# EAGLE design Master_V0.1 (EAGLE 9.6.2)

## Sheet 1 of 2
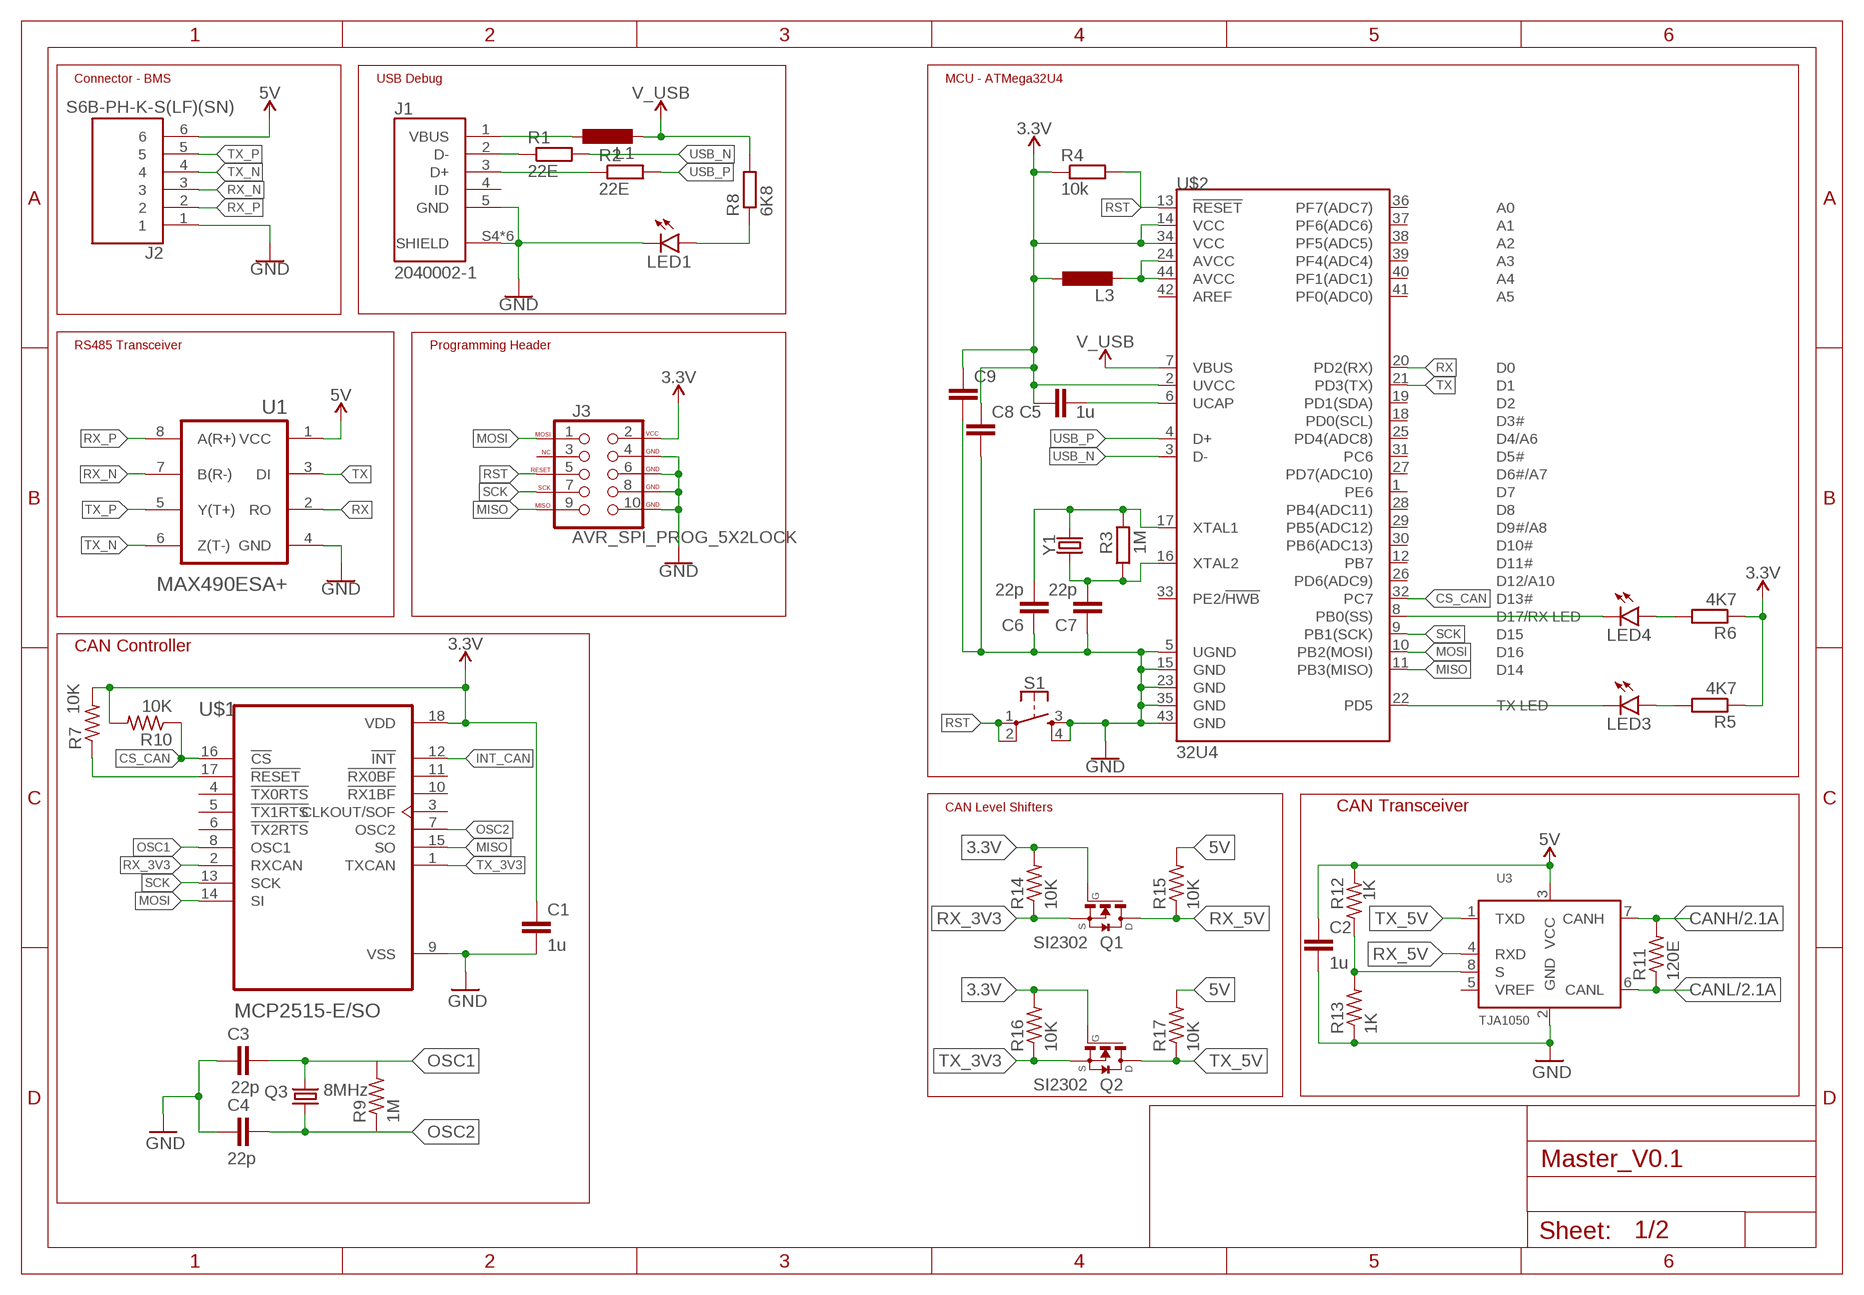
[diagram p0: schematic, sheet 1]

### Parts
C1  1u  C-EUC0805  [C0805]
C2  1u  C-EUC0805  [C0805]
C3  22p  C-EUC0805  [C0805]
C4  22p  C-EUC0805  [C0805]
C5  1u  C-EUC0805  [C0805]
C6  22p  C-EUC0805  [C0805]
C7  22p  C-EUC0805  [C0805]
C8  C-EUC0805  [C0805]
C9  C-EUC0805  [C0805]
J1  2040002-1  [TE_2040002-1]
J2  S6B-PH-K-S(LF)(SN)  [JST_S6B-PH-K-S(LF)(SN)]
J3  AVR_SPI_PROG_5X2LOCK  [2X5-SHROUDED_LOCK]
L1  L-EUL2012C  [L2012C]
L3  L-EUL2012C  [L2012C]
LED1  LEDCHIPLED_0805  [CHIPLED_0805]
LED3  LEDCHIPLED_0805  [CHIPLED_0805]
LED4  LEDCHIPLED_0805  [CHIPLED_0805]
Q1  SI2302  [SOT23]
Q2  SI2302  [SOT23]
Q3  8MHz  CRYSTALHC49S  [HC49/S]
R1  22E  R-EU_R0805  [R0805]
R2  22E  R-EU_R0805  [R0805]
R3  1M  R-EU_R0805  [R0805]
R4  10k  R-EU_R0805  [R0805]
R5  4K7  R-EU_R0805  [R0805]
R6  4K7  R-EU_R0805  [R0805]
R7  10K  R-US_R0805  [R0805]
R8  6K8  R-EU_R0805  [R0805]
R9  1M  R-US_R0805  [R0805]
R10  10K  R-US_R0805  [R0805]
R11  120E  R-US_R0805  [R0805]
R12  1K  R-US_R0805  [R0805]
R13  1K  R-US_R0805  [R0805]
R14  10K  R-US_R0805  [R0805]
R15  10K  R-US_R0805  [R0805]
R16  10K  R-US_R0805  [R0805]
R17  10K  R-US_R0805  [R0805]
S1  MOMENTARY-SWITCH-SPST-2-SMD-5.2MM  [TACTILE_SWITCH_SMD_5.2MM]
U1  MAX490ESA+  [SOIC127P600X175-8N]
U3  TJA1050  [SOT96-1]
U$1  MCP2515-E/SO  [SOIC127P1030X265-18N]
U$2  32U4  ATMEGA32U4TQFP-44  [TQFP44]
Y1  CRYSTALPTH-HC49UV  [HC49U]

### Nets
3.3V: C1.1 C5.1 C8.1 C9.1 J3.2(VCC) L3.1 Q1.1(G) Q2.1(G) R4.1 R5.1 R6.1 R7.2 R10.2 R14.2 R16.2 U$1.18(VDD) U$2.2(UVCC) U$2.14(VCC) U$2.34(VCC) ; also sheet 2
5V: C2.1 J2.6 R12.2 R15.2 R17.2 U1.1(VCC) U3.3(VCC) ; also sheet 2
CANH: R11.2 U3.7(CANH) ; also sheet 2
CANL: R11.1 U3.6(CANL) ; also sheet 2
CS_CAN: R10.1 U$1.16(!CS) U$2.32(PC7)
GND: C1.2 C2.2 C3.1 C4.1 C6.1 C7.1 C8.2 C9.2 J1.5(GND) J1.S4(SHIELD) J1.S5(SHIELD) J1.SH1(SHIELD) J1.SH2(SHIELD) J1.SH3(SHIELD) J1.SH4(SHIELD) J2.1 J3.4(GND) J3.6(GND) J3.8(GND) J3.10(GND) LED1.C R13.1 S1.3 S1.4 U1.4(GND) U3.2(GND) U$1.9(VSS) U$2.5(UGND) U$2.15(GND) U$2.23(GND) U$2.35(GND) U$2.43(GND) ; also sheet 2
INT_CAN: U$1.12(!INT)
MISO: J3.9(MISO) U$1.15(SO) U$2.11(PB3(MISO))
MOSI: J3.1(MOSI) U$1.14(SI) U$2.10(PB2(MOSI))
N$1: J1.3(D+) R2.1
N$2: J1.2(D-) R1.1
N$3: J1.1(VBUS) L1.1
N$4: L3.2 U$2.24(AVCC) U$2.44(AVCC)
N$5: LED1.A R8.1
N$6: R7.1 U$1.17(!RESET)
N$7: C5.2 U$2.6(UCAP)
N$8: LED3.C U$2.22(PD5)
N$9: C6.2 R3.2 U$2.17(XTAL1) Y1.2
N$10: LED3.A R5.2
N$11: C7.2 R3.1 U$2.16(XTAL2) Y1.1
N$12: LED4.C U$2.8(PB0(SS))
N$13: LED4.A R6.2
N$18: R12.1 R13.2 U3.8(S)
OSC1: C3.2 Q3.2 R9.2 U$1.8(OSC1)
OSC2: C4.2 Q3.1 R9.1 U$1.7(OSC2)
RST: J3.5(RESET) R4.2 S1.1 S1.2 U$2.13(!RESET)
RX: U1.2(RO) U$2.20(PD2(RX))
RX_3V3: Q1.2(S) R14.1 U$1.2(RXCAN)
RX_5V: Q1.3(D) R15.1 U3.4(RXD)
RX_N: J2.3 U1.7(B(R-))
RX_P: J2.2 U1.8(A(R+))
SCK: J3.7(SCK) U$1.13(SCK) U$2.9(PB1(SCK))
TX: U1.3(DI) U$2.21(PD3(TX))
TX_3V3: Q2.2(S) R16.1 U$1.1(TXCAN)
TX_5V: Q2.3(D) R17.1 U3.1(TXD)
TX_N: J2.4 U1.6(Z(T-))
TX_P: J2.5 U1.5(Y(T+))
USB_N: R1.2 U$2.3(D-)
USB_P: R2.2 U$2.4(D+)
V_USB: L1.2 R8.2 U$2.7(VBUS)
Unconnected: J1.4(ID) J3.3(NC) U3.5(VREF) U$1.3(CLKOUT/SOF) U$1.4(!TX0RTS) U$1.5(!TX1RTS) U$1.6(!TX2RTS) U$1.10(!RX1BF) U$1.11(!RX0BF) U$2.1(PE6) U$2.12(PB7) U$2.18(PD0(SCL)) U$2.19(PD1(SDA)) U$2.25(PD4(ADC8)) U$2.26(PD6(ADC9)) U$2.27(PD7(ADC10)) U$2.28(PB4(ADC11)) U$2.29(PB5(ADC12)) U$2.30(PB6(ADC13)) U$2.31(PC6) U$2.33(PE2/!HWB) U$2.36(PF7(ADC7)) U$2.37(PF6(ADC6)) U$2.38(PF5(ADC5)) U$2.39(PF4(ADC4)) U$2.40(PF1(ADC1)) U$2.41(PF0(ADC0)) U$2.42(AREF)

### Notes on the sheet
- Connector - BMS | USB Debug | MCU - ATMega32U4
- RS485 Transceiver | Programming Header
- CAN Controller
- CAN Level Shifters | CAN Transceiver

## Sheet 2 of 2
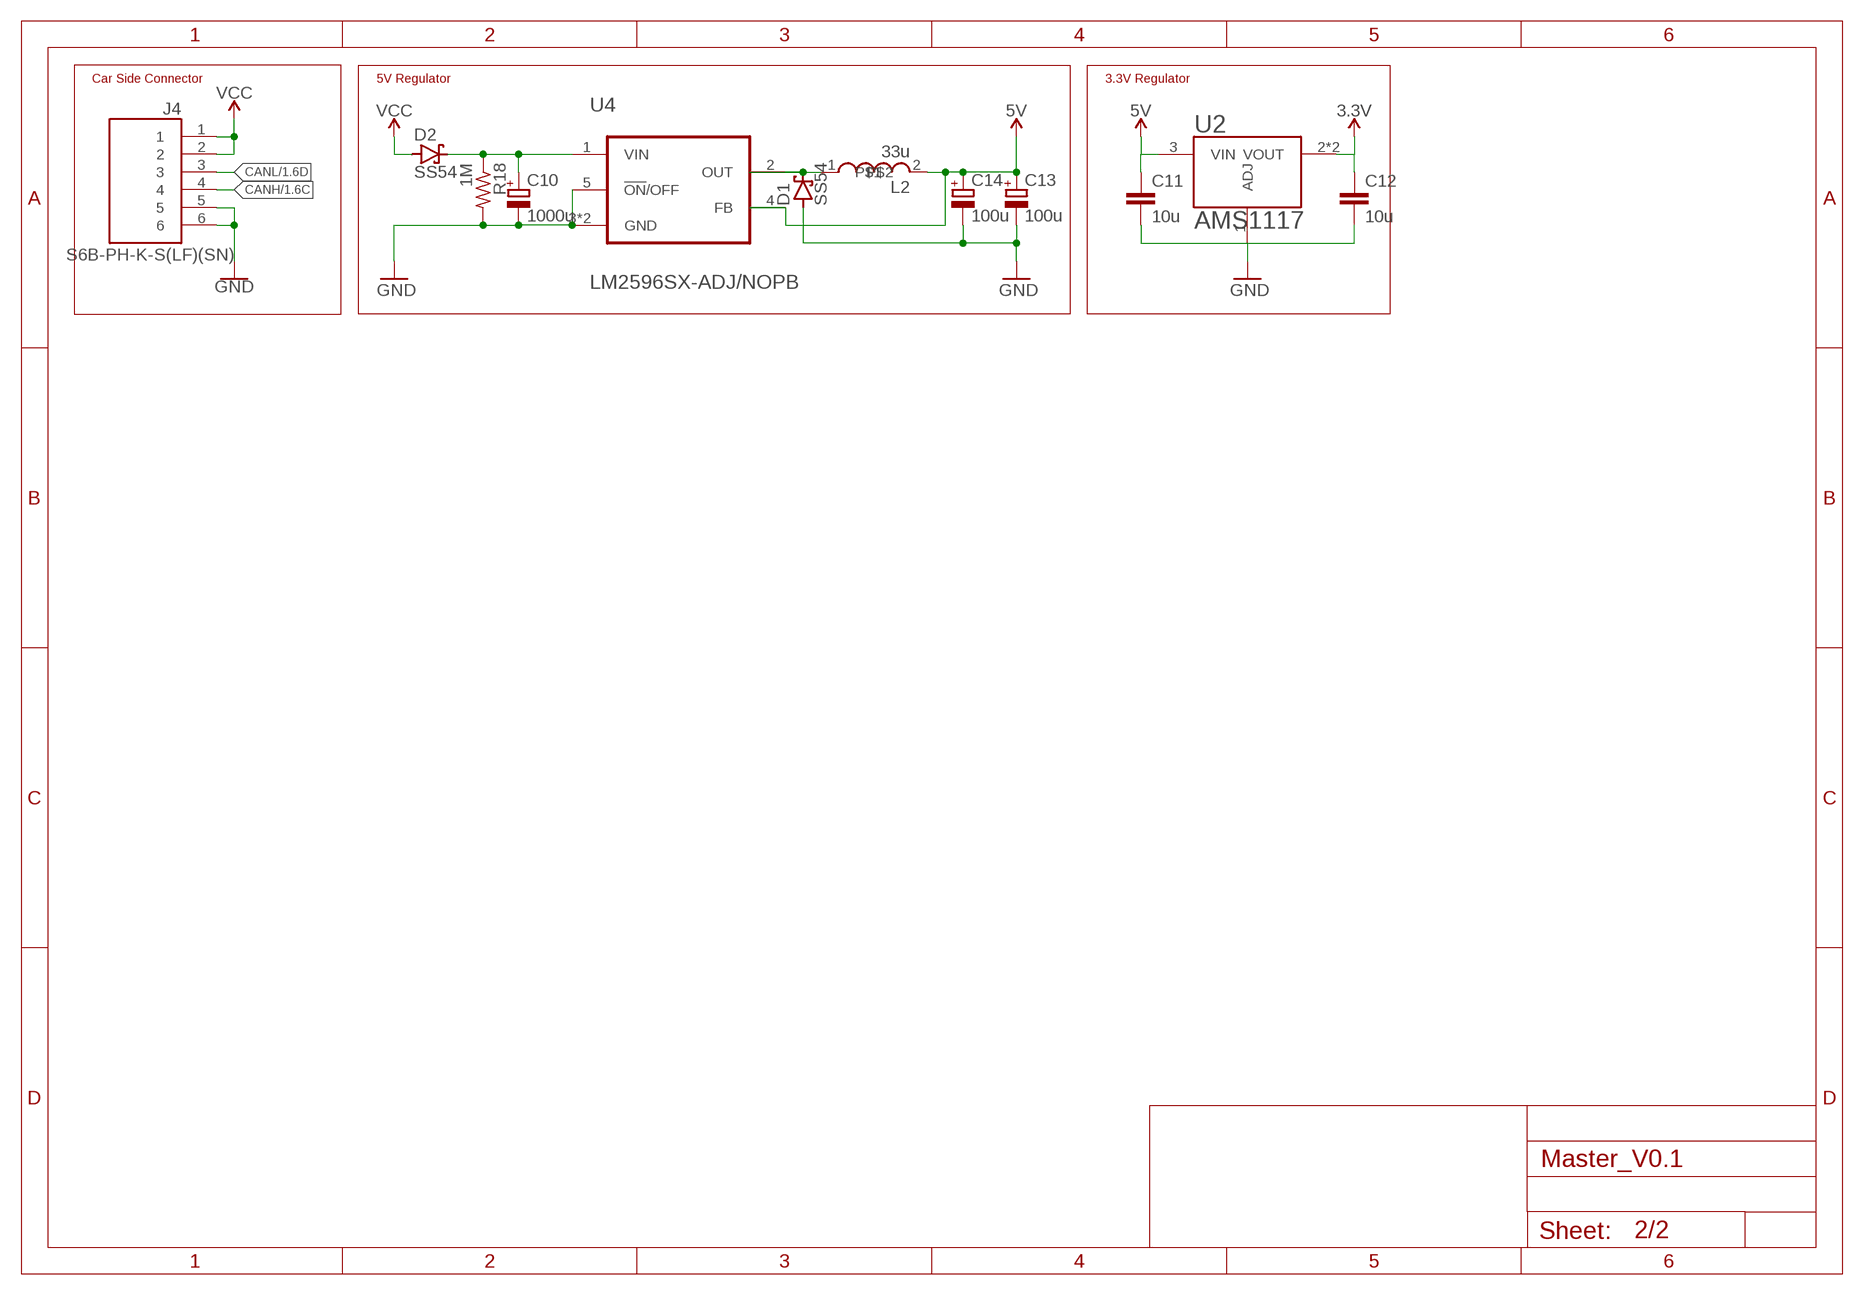
[diagram p1: schematic, sheet 2]

### Parts
C10  1000u  CPOL-EUE5-10.5  [E5-10,5]
C11  10u  C-EUC0805  [C0805]
C12  10u  C-EUC0805  [C0805]
C13  100u  CPOL-EUE2-4  [E2-4]
C14  100u  CPOL-EUE2-4  [E2-4]
D1  SS54  SCHOTTKY-DIODESMC  [SMC]
D2  SS54  SCHOTTKY-DIODESMC  [SMC]
J4  S6B-PH-K-S(LF)(SN)  [JST_S6B-PH-K-S(LF)(SN)]
L2  33u  CDRH127/LDCDRH/LD  [CDRH127/LD]
R18  1M  R-US_R0805  [R0805]
U2  AMS1117  [SOT230P700X170-4]
U4  LM2596SX-ADJ/NOPB  [VREG_LM2596SX-ADJ/NOPB]

### Nets
3.3V: C12.1 U2.2(VOUT) U2.4(VOUT) ; also sheet 1
5V: C11.1 C13.+ C14.+ L2.2 U2.3(VIN) U4.4(FB) ; also sheet 1
CANH: J4.4 ; also sheet 1
CANL: J4.3 ; also sheet 1
GND: C10.- C11.2 C12.2 C13.- C14.- D1.A J4.5 J4.6 R18.2 U2.1(ADJ) U4.3(GND) U4.5(!ON!/OFF) U4.6(GND) ; also sheet 1
N$14: D1.C L2.1 U4.2(OUT)
N$15: C10.+ D2.C R18.1 U4.1(VIN)
VCC: D2.A J4.1 J4.2

### Notes on the sheet
- Car Side Connector | 5V Regulator | 3.3V Regulator

## Library data of the parts
C1-C9 C11 C12 = rcl:C-EU: CAPACITOR, European symbol; SPICEPREFIX: C
C10 C13 C14 = rcl:CPOL-EU: POLARIZED CAPACITOR, European symbol; SPICEPREFIX: C
D1 D2 = diode:SCHOTTKY-DIODE: Schottky Diode
J1 = 2040002-1:2040002-1: Conn USB Type B RCP 5 POS 0.65mm Solder RA SMD 5 Terminal 1 Port T/R; AVAILABILITY: Unavailable; CENTERLINE_PITCH: .65 mm[.025 in]; COMMENT: 2040002-1; DESCRIPTION: Conn Micro USB 2.0 Type B RCP 5 POS 0.65mm Solder RA SMD 5 Terminal 1 Port T/R; MF: TE Connectivity; MP: 2040002-1; NUMBER_OF_POSITIONS: 5; PACKAGE: None; PRICE: None; PRODUCT_TYPE: Connector; TE_PURCHASE_URL: https://www.te.com/usa-en/product-2040002-1.html?te_bu=Cor&te_type=disp&te_campaign=seda_glo_cor-seda-global-disp-prtnr-fy19-seda-model-bom-cta_sma-317_1&elqCampaignId=32493
J2 J4 = S6B-PH-K-S_LF__SN_:S6B-PH-K-S(LF)(SN): PH Series 6 Position 2 mm Pitch Through Hole Side Entry Shrouded Header; AVAILABILITY: Unavailable; DESCRIPTION: Connector Header Through Hole, Right Angle 6 position 0.079 (2.00mm); MF: JST Sales; MP: S6B-PH-K-S(LF)(SN); PACKAGE: None; PRICE: None
J3 = SparkFun-Connectors:AVR_SPI_PROG_5X2: AVR 10-pin ICSP Header This is the standard AVR In Circuit Serial Programming header. Minimal, but includes pin one indicator. Works with standard Olimex programmers. SparkFun Products: 2x5 AVR ICSP Male Header <https://www.sparkfun.com/products/778> - PTH 2x5 Pin Shrouded Header <https://www.sparkfun.com/products/8506> - PTH2; PROD_ID: CONN-08671; SF_ID: PRT-08506
L1 L3 = rcl:L-EU: INDUCTOR, European symbol; SPICEPREFIX: L
L2 = L-CDRH127_LD:CDRH127/LD
LED1 LED3 LED4 = led:LED: LED OSRAM: - CHIPLED LG R971, LG N971, LY N971, LG Q971, LY Q971, LO R971, LY R971 LH N974, LH R974 LS Q976, LO Q976, LY Q976 LO Q996 - Hyper CHIPLED LW Q18S LB Q993, LB Q99A, LB R99A - SideLED LS A670, LO A670, LY A670, LG A670, LP A670 LB A673, LV A673, LT A673, LW A673 LH A674 LY A675 LS A676, LA A676, LO A676, LY A676, LW A676 LS A679, LY A679, LG A679 - Hyper Micro SIDELED® LS Y876, LA Y876, LO Y876, LY Y876 LT Y87S - SmartLED LW L88C, LW L88S LB L89C, LB L89S, LG L890 LS L89K, LO L89K, LY L89K LS L896, LA L896, LO L896, LY L896 - TOPLED LS T670, LO T670, LY T670, LG T670, LP T670 LSG T670, LSP T670, LSY T670, LOP T670, LYG T670 LG T671, LOG T671, LSG T671 LB T673, LV T673, LT T673, LW T673 LH T674 LS T676, LA T676, LO T676, LY T676, LB T676, LH T676, LSB T676, LW T676 LB T67C, LV T67C, LT T67C, LS T67K, LO T67K, LY T67K, LW E67C LS E67B, LA E67B, LO E67B, LY E67B, LB E67C, LV E67C, LT E67C LW T67C LS T679, LY T679, LG T679 LS T770, LO T770, LY T770, LG T770, LP T770 LB T773, LV T773, LT T773, LW T773 LH T774 LS E675, LA E675, LY E675, LS T675 LS T776, LA T776, LO T776, LY T776, LB T776 LHGB T686 LT T68C, LB T68C - Hyper Mini TOPLED® LB M676 - Mini TOPLED Santana® LG M470 LS M47K, LO M47K, LY M47K Source: http://www.osram.convergy.de LUXEON: - LUMILED® LXK2-PW12-R00, LXK2-PW12-S00, LXK2-PW14-U00, LXK2-PW14-V00 LXK2-PM12-R00, LXK2-PM12-S00, LXK2-PM14-U00 LXK2-PE12-Q00, LXK2-PE12-R00, LXK2-PE12-S00, LXK2-PE14-T00, LXK2-PE14-U00 LXK2-PB12-K00, LXK2-PB12-L00, LXK2-PB12-M00, LXK2-PB14-N00, LXK2-PB14-P00, LXK2-PB14-Q00 LXK2-PR12-L00, LXK2-PR12-M00, LXK2-PR14-Q00, LXK2-PR14-R00 LXK2-PD12-Q00, LXK2-PD12-R00, LXK2-PD12-S00 LXK2-PH12-R00, LXK2-PH12-S00 LXK2-PL12-P00, LXK2-PL12-Q00, LXK2-PL12-R00 Source: www.luxeon.com KINGBRIGHT: KA-3528ASYC Source: www.kingbright.com
Q1 Q2 = SI2302:SI2302: MOSFET N-Channel 20 V (D-S); AVAILABILITY: Unavailable; DESCRIPTION: N-Channel 20V 2.6A _Ta_ 710mW _Ta_ Surface Mount SOT-23-3 _TO-236_; MF: Vishay Siliconix; MP: SI2302; PACKAGE: SOT-23-3 Vishay Siliconix; PRICE: None
Q3 = crystal:CRYSTAL: CRYSTAL; OC_FARNELL: 1667008; OC_NEWARK: unknown
R1-R6 R8 = rcl:R-EU_: RESISTOR, European symbol; SPICEPREFIX: R
R7 R9-R18 = rcl:R-US_: RESISTOR, American symbol; SPICEPREFIX: R
S1 = SparkFun-Switches:MOMENTARY-SWITCH-SPST-2: Momentary Switch (Pushbutton) - SPST - Two Circuits Normally-open (NO) SPST momentary switches (buttons, pushbuttons). Schematic symbol includes two switch circuits. Variants SMD-4.6MMX2.8MM - 4.60mm x 2.80mm Tactile Momentary Button Switch - Used on SparkFun SAMD21 Mini Breakout <https://www.sparkfun.com/products/13664> SMD-5.2MM - Mini Pushbutton Switch - SMD <https://www.sparkfun.com/products/8720> - Used on Arduino Pro Mini <https://www.sparkfun.com/products/11114>; PROD_ID: SWCH-08247; SF_SKU: COM-08720
U1 = MAX490ESA_:MAX490ESA+: None Check prices <https://snapeda.com/parts/MAX490ESA%2B/Maxim%20Integrated/view-part/?ref=eda>; AVAILABILITY: Warning; DESCRIPTION: 1/1 Transceiver Full RS422, RS485 8-SOIC; DIGIKEY-PURCHASE-URL: https://snapeda.com/shop?store=DigiKey&id=1237744; MF: Maxim Integrated; MOUSER-PURCHASE-URL: https://snapeda.com/shop?store=Mouser&id=1237744; MP: MAX490ESA+; PACKAGE: SOIC-8 Maxim; PRICE: None
U2 = AMS1117:AMS1117: Sot223/Pkg 1-Amp 5-Volt Low Drop Out Voltage Regulatator; DATASHEET-URL: http://www.advanced-monolithic.com/pdf/ds1117.pdf; DESCRIPTION: 3.3V 1A LDO; MF: Advanced Monolithic Systems, Inc.; MP: AMS1117; PACKAGE: SOT-223; PURCHASE-URL: https://www.evelta.com/ams1117-3-3-advanced-monolithic-systems-3-3v-1a-ldo-voltage-regulator/
U3 = TJA1050:TJA1050: High speed CAN transceiver The TJA1050 is the interface between the Controller Area Network (CAN) protocol controller and the physical bus. The device provides differential transmit capability to the bus and differential receive capability to the CAN controller. The TJA1050 is the third Philips high-speed CAN transceiver after the PCA82C250 and the PCA82C251. The most important differences are: Much lower electromagnetic emission due to optimal matching of the output signals CANH and CANL Improved behaviour in case of an unpowered node No standby mode. This makes the TJA1050 eminently suitable for use in nodes that are in a power-down situation in partially powered networks. AAL Eindhoven MK; AVAILABILITY: Unavailable; DESCRIPTION: 1/1 Transceiver Half CANbus 8-SO; MF: NXP USA; MP: TJA1050; PACKAGE: SOIC-8 NXP USA; PRICE: None
U4 = LM2596SX-ADJ_NOPB:LM2596SX-ADJ/NOPB: Check prices <https://pricing.snapeda.com/parts/LM2596SX-ADJ/NOPB/Texas%20Instruments/view-part?ref=eda>; AVAILABILITY: Good; DESCRIPTION: SIMPLE SWITCHER&reg; 4.5V to 40V, 3A Low Component Count Step-Down Regulator 5-DDPAK/TO-263 -40 to 125; MF: Texas Instruments; MP: LM2596SX-ADJ/NOPB; PACKAGE: TO-263-5 Texas Instruments; PRICE: None; PURCHASE-URL: https://pricing.snapeda.com/search/part/LM2596SX-ADJ/NOPB/?ref=eda
U$1 = MCP2515-E_SO:MCP2515-E/SO; AVAILABILITY: Unavailable; DESCRIPTION: CANbus Controller CAN 2.0 SPI Interface 18-SOIC; MF: Microchip; MP: MCP2515-E/SO; PACKAGE: SOIC-18 Microchip; PRICE: None
U$2 = SparkFun-IC-Microcontroller:ATMEGA32U4: Atmel MCU, 32KByte Atmel 44-pin 8-bit Microcontroller with 32KBytes of ISP Flash and USB Controller Datasheet <http://cdn.sparkfun.com/datasheets/Dev/Arduino/Boards/ATMega32U4.pdf> SparkFun Products LilyPad Arduino USB - ATmega32U4 Board <https://www.sparkfun.com/products/12049> (DEV-12049) Pro Micro - 5V/16MHz <https://www.sparkfun.com/products/12640> (DEV-12640) Pro Micro - 3.3V/8MHz <https://www.sparkfun.com/products/12587> (DEV-12587) Fio v3 - ATmega32U4 <https://www.sparkfun.com/products/11520> (DEV-11520) Qduino Mini <https://www.sparkfun.com/products/13614> (DEV-13614) Makey Makey - Standard Kit <https://www.sparkfun.com/products/11511> (WIG-11511) Makey Makey Deluxe Kit <https://www.sparkfun.com/products/11519> (WIG-11519); PROD_ID: IC-11161
Y1 = SparkFun-Clocks:CRYSTAL: Crystals (Generic) These are passive quartz crystals, which can be used as a clock source for a microcontroller. Crystal's are two-terminal devices. They require external "load" capacitors to generate an oscillating signal.

## Net classes
1 Power: width 0.508 mm, clearance 0.406 mm

## Board
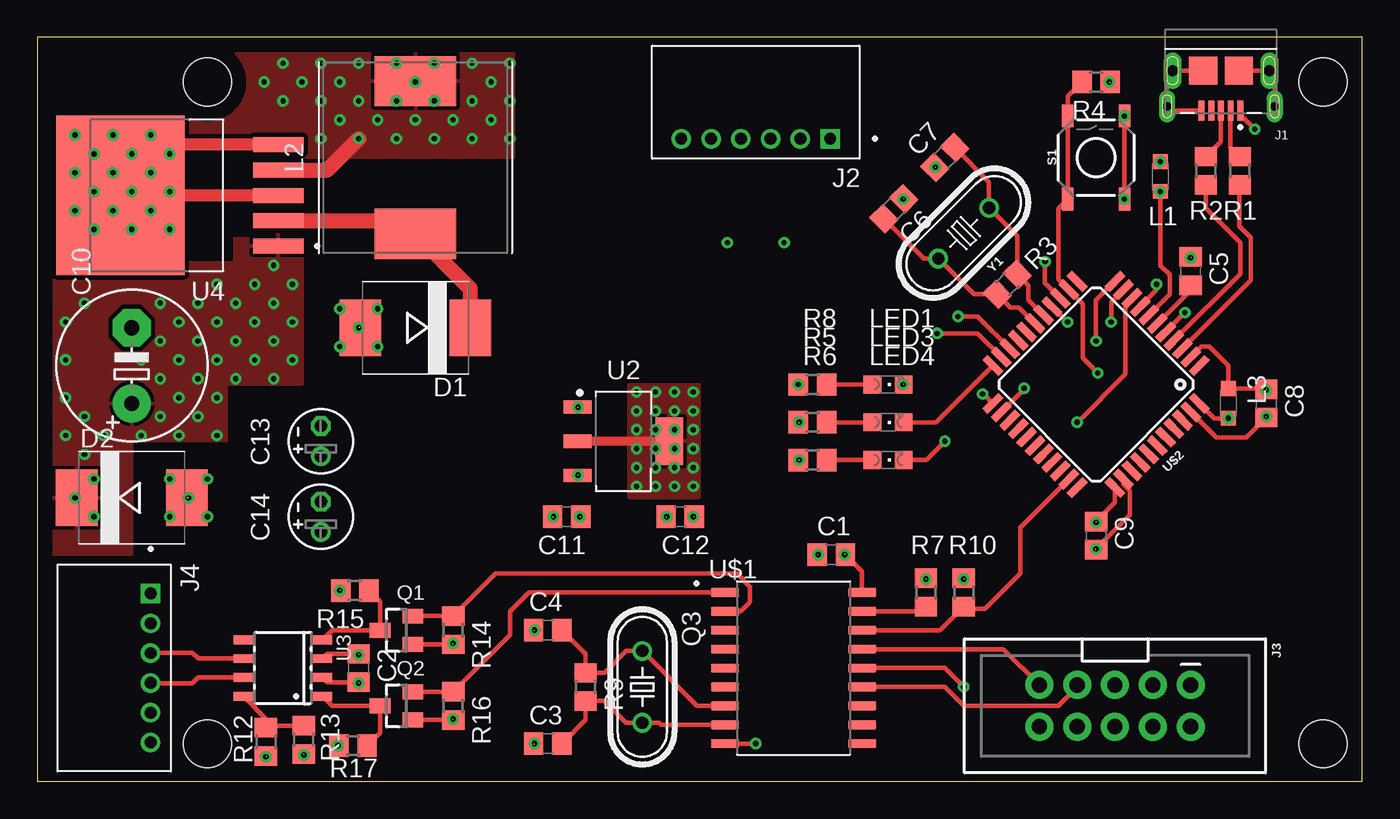
[diagram p2: board, top side]
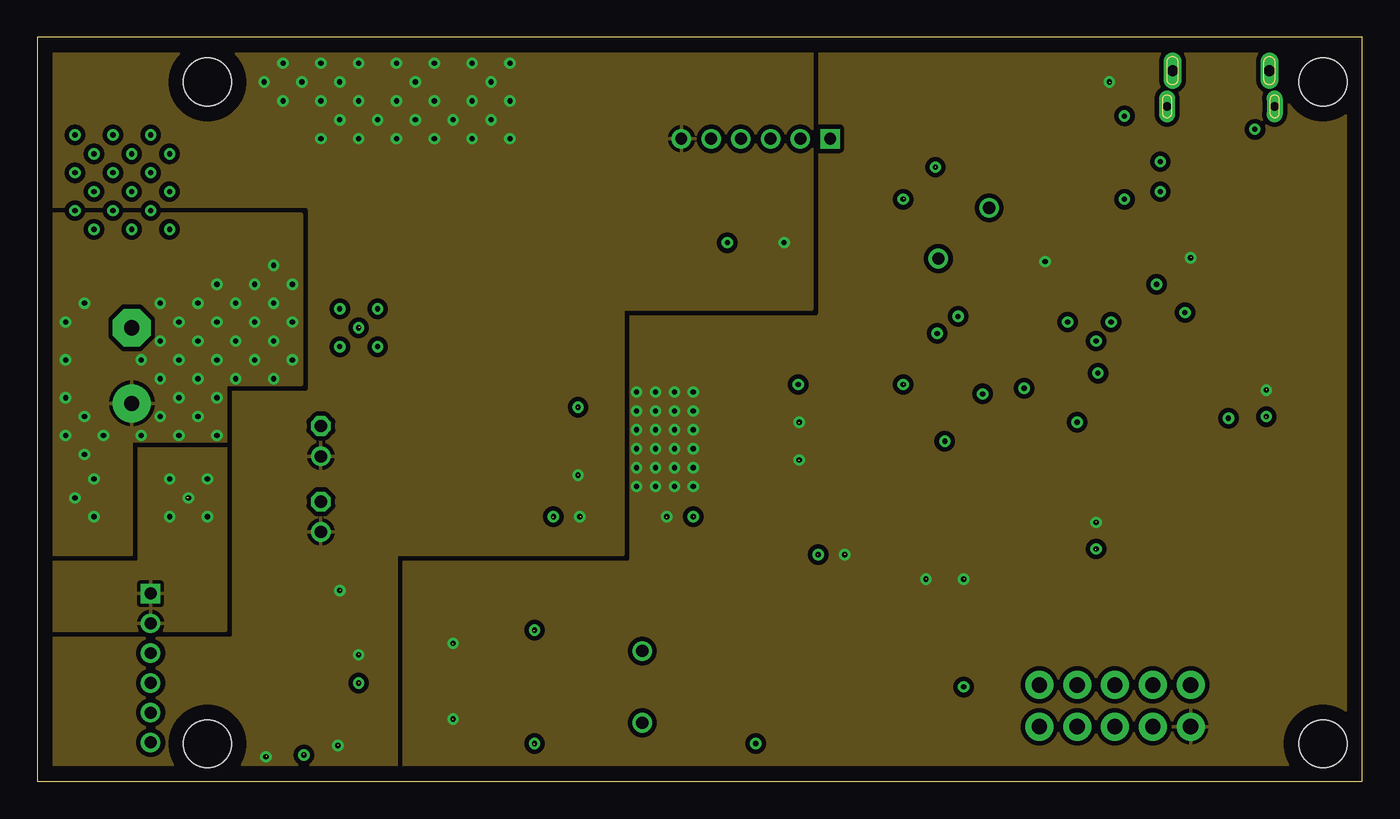
[diagram p3: board, inner layer PWR]
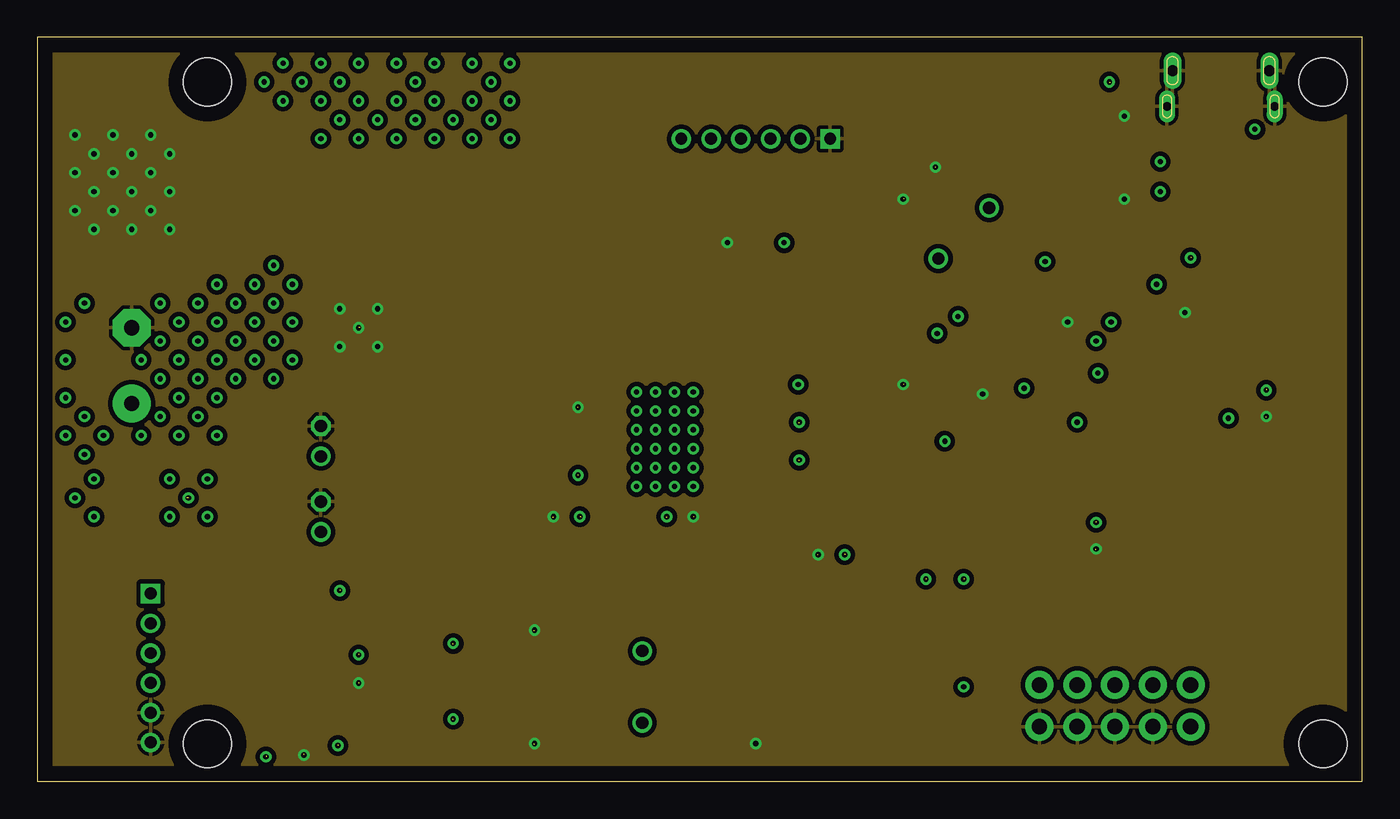
[diagram p4: board, inner layer GND]
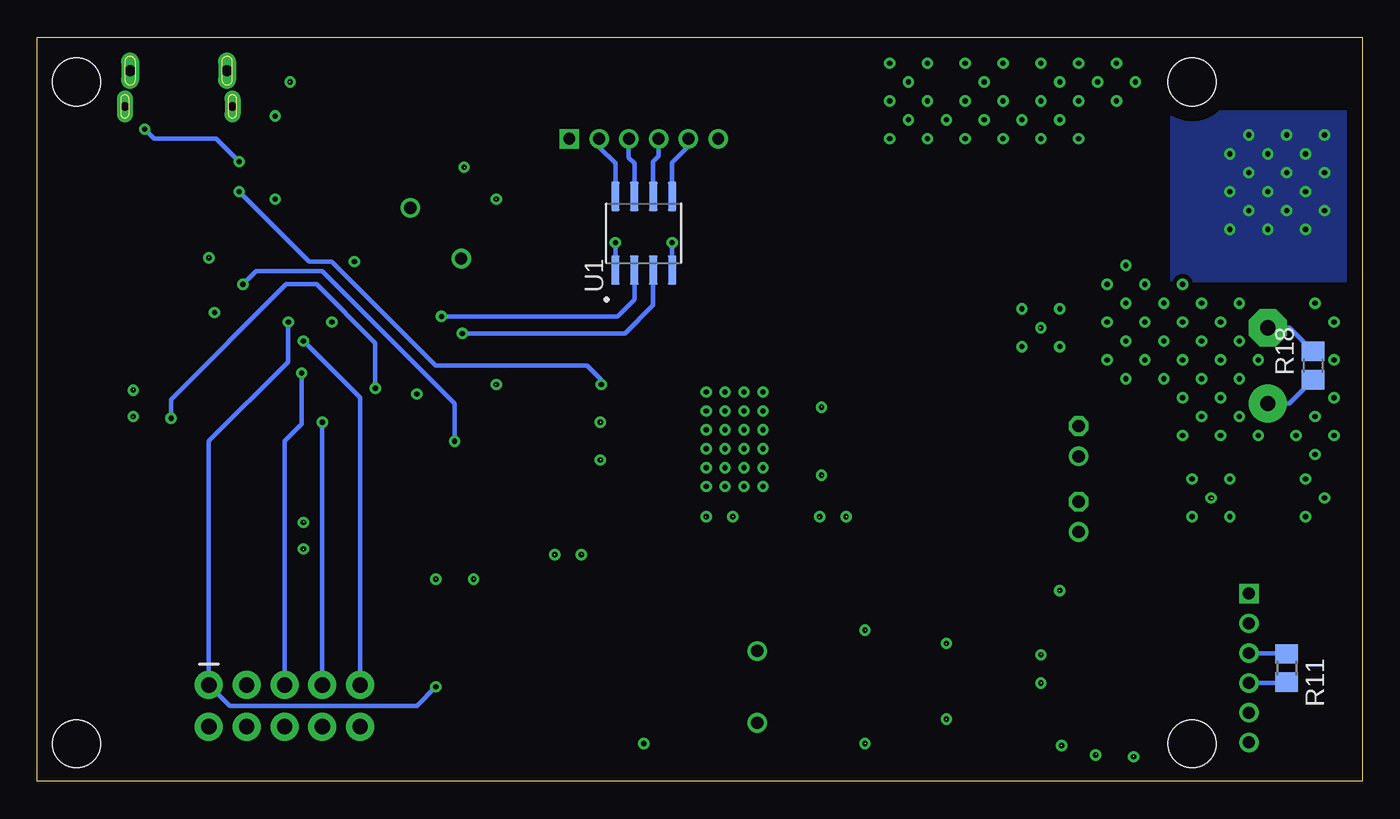
[diagram p5: board, bottom side, seen from below]

Size 89 x 50 mm. Coordinates in mm from the lower left corner, seen from the top.
Outline: 0,0 89,0 89,50 0,50 0,0
Copper layers (1+2*15+16): Top 0.035mm / dielectric 1.5mm / PWR 0.035mm / dielectric 0.15mm / GND 0.035mm / dielectric 0.2mm / Bottom 0.035mm
Design rules "default *": minimum track width 8mil, minimum drill 0.35mm, track to track 6mil, track to pad 6mil, pad to pad 6mil, via to via 6mil, smd to smd 6mil, copper to edge 40mil, drill to drill 6mil, minimum pad ring 10mil, minimum via ring 8mil, stop-mask expansion 4mil, vias tented up to drill 15mil, thermal gap 10mil
Holes 3.2 mm at 11.43,2.54 11.43,46.99 86.36,46.99 86.36,2.54 86.36,2.54

### Footprints (pad centres in the part's own frame; a part is rotated, then mirrored left to right if it is on the bottom)
C0805 = smd 1.3 x 1.5: 1 -0.95,0; 2 0.95,0
E5-10,5 = drill 1.016 pad 2.54: + -2.54,0 | drill 1.016 pad 2.54 octagon: - 2.54,0
E2-4 = drill 0.813 pad 1.27: + -1.016,0 | drill 0.813 pad 1.27 octagon: - 1.016,0
SMC = smd 2.8 x 3.8: A 3.7,0; C -3.7,0
TE_2040002-1 = smd 0.4 x 1.35: 1 -1.3,2.675; 2 -0.65,2.675; 3 0,2.675; 4 0.65,2.675; 5 1.3,2.675 | smd 1.9 x 1.9: S4 -1.2,0; S5 1.2,0 | drill 0.56 long: SH1 -3.615,2.4; SH2 3.615,2.4 | drill 0.71 long: SH3 3.255,0; SH4 -3.255,0
JST_S6B-PH-K-S(LF)(SN) = drill 0.8 pad 1.2 square: 1 -5,0 | drill 0.8 pad 1.2: 2 -3,0; 3 -1,0; 4 1,0; 5 3,0; 6 5,0
2X5-SHROUDED_LOCK = drill 1.016 pad 1.88: 1 -1.397,5.08; 2 1.397,5.08; 3 -1.397,2.54; 4 1.397,2.54; 5 -1.397,0; 6 1.397,0; 7 -1.397,-2.54; 8 1.397,-2.54; 9 -1.397,-5.08; 10 1.397,-5.08
L2012C = smd 1 x 1: 1 -1,0; 2 1,0
CDRH127/LD = smd 3.36 x 5.5: 1 -5.12,0; 2 5.12,0
CHIPLED_0805 = smd 1.2 x 1.2: A 0,-1.05; C 0,1.05
SOT23 = smd 1 x 1.4: 1 -0.95,-1.1; 2 0.95,-1.1; 3 0,1.1
HC49/S = drill 0.813: 1 -2.413,0; 2 2.413,0
R0805 = smd 1.3 x 1.5: 1 -0.95,0; 2 0.95,0
TACTILE_SWITCH_SMD_5.2MM = smd 1.524 x 0.762: 1 -2.794,1.905; 2 2.794,1.905; 3 -2.794,-1.905; 4 2.794,-1.905
SOIC127P600X175-8N = smd 1.97 x 0.59: 1 -2.475,1.905; 2 -2.475,0.635; 3 -2.475,-0.635; 4 -2.475,-1.905; 5 2.475,-1.905; 6 2.475,-0.635; 7 2.475,0.635; 8 2.475,1.905
SOT230P700X170-4 = smd 1.86 x 0.898: 1 -3.075,2.3; 2 -3.075,0; 3 -3.075,-2.3 | smd 1.86 x 3.189: 4 3.075,0
SOT96-1 = smd 0.6 x 1.3: 1 -1.905,-2.65; 2 -0.635,-2.65; 3 0.635,-2.65; 4 1.905,-2.65; 5 1.905,2.65; 6 0.635,2.65; 7 -0.635,2.65; 8 -1.905,2.65
VREG_LM2596SX-ADJ/NOPB = smd 3.4 x 1: 1 -10.6,3.4; 2 -10.6,1.7; 3 -10.6,0; 4 -10.6,-1.7; 5 -10.6,-3.4 | smd 8.6 x 10.7: 6 0,0
SOIC127P1030X265-18N = smd 1.91 x 0.6: 1 -4.61,5.08; 2 -4.61,3.81; 3 -4.61,2.54; 4 -4.61,1.27; 5 -4.61,0; 6 -4.61,-1.27; 7 -4.61,-2.54; 8 -4.61,-3.81; 9 -4.61,-5.08; 10 4.61,-5.08; 11 4.61,-3.81; 12 4.61,-2.54; 13 4.61,-1.27; 14 4.61,0; 15 4.61,1.27; 16 4.61,2.54; 17 4.61,3.81; 18 4.61,5.08
TQFP44 = smd 1.5 x 0.5: 1 -5.8,4; 2 -5.8,3.2; 3 -5.8,2.4; 4 -5.8,1.6; 5 -5.8,0.8; 6 -5.8,0; 7 -5.8,-0.8; 8 -5.8,-1.6; 9 -5.8,-2.4; 10 -5.8,-3.2; 11 -5.8,-4; 23 5.8,-4; 24 5.8,-3.2; 25 5.8,-2.4; 26 5.8,-1.6; 27 5.8,-0.8; 28 5.8,0; 29 5.8,0.8; 30 5.8,1.6; 31 5.8,2.4; 32 5.8,3.2; 33 5.8,4 | smd 0.5 x 1.5: 12 -4,-5.8; 13 -3.2,-5.8; 14 -2.4,-5.8; 15 -1.6,-5.8; 16 -0.8,-5.8; 17 0,-5.8; 18 0.8,-5.8; 19 1.6,-5.8; 20 2.4,-5.8; 21 3.2,-5.8; 22 4,-5.8; 34 4,5.8; 35 3.2,5.8; 36 2.4,5.8; 37 1.6,5.8; 38 0.8,5.8; 39 0,5.8; 40 -0.8,5.8; 41 -1.6,5.8; 42 -2.4,5.8; 43 -3.2,5.8; 44 -4,5.8
HC49U = drill 0.813: 1 -2.413,0; 2 2.413,0

### Placement (x,y rotation side)
C1  53.34,15.24 180 top
C2  21.59,7.62 270 top
C3  34.29,2.54 0 top
C4  34.29,10.16 0 top
C5  77.47,34.29 270 top
C6  57.53,38.48 225 top
C7  60.96,41.91 45 top
C8  82.55,25.4 270 top
C9  71.12,16.51 270 top
C10  6.35,27.94 90 top
C11  35.56,17.78 180 top
C12  43.18,17.78 0 top
C13  19.05,22.86 90 top
C14  19.05,17.78 90 top
D1  25.4,30.48 180 top
D2  6.35,19.05 0 top
J1  79.5,47.75 180 top
J2  48.26,43.18 180 top
J3  72.39,5.08 270 top
J4  7.62,7.62 270 top
L1  75.44,40.64 270 top
L2  25.4,41.91 90 top
L3  80.01,25.4 270 top
LED1  57.15,26.67 270 top
LED3  57.15,24.13 270 top
LED4  57.15,21.59 270 top
Q1  24.13,10.16 90 top
Q2  24.13,5.08 90 top
Q3  40.64,6.35 270 top
R1  80.77,41.02 270 top
R2  78.49,41.02 270 top
R3  65.15,33.4 225 top
R4  71.12,46.99 180 top
R5  52.07,24.13 0 top
R6  52.07,21.59 0 top
R7  59.69,12.7 90 top
R8  52.07,26.67 180 top
R9  36.83,6.35 270 top
R10  62.23,12.7 90 top
R11  5.08,7.62 270 bottom
R12  15.37,2.67 270 top
R13  17.91,2.79 90 top
R14  27.94,10.16 270 top
R15  21.34,12.83 180 top
R16  27.94,5.08 270 top
R17  21.21,2.41 180 top
R18  3.3,27.94 90 bottom
S1  71.12,41.91 90 top
U1  48.26,36.83 90 bottom
U2  39.37,22.86 0 top
U3  16.51,7.62 90 top
U4  5.59,39.37 180 top
U$1  50.8,7.62 0 top
U$2  71.12,26.67 225 top
Y1  62.23,36.83 225 top

### Tracks (layer width: path | path; a pad name or v marks a point on that pad's centre or on a via)
3.3V  (via drill 0.35)  (12 unrouted)
  Top 0.305: Q2.1 R16.2 | Q1.1 R14.2 | U$1.18 55.41,14.12 C1.1 | U$2.14 67.69,33.49 v67.69,34.92 | U$2.34 72.39,18.73 C9.1 | v82.55,26.29 82.44,26.4 L3.1 80.01,27.94 78.74,29.21 78.19,29.21 U$2.2
  Top 0.61: U2.2 U2.4
  other vias: 27.94,9.27 27.94,4.19 42.29,17.78 51.18,21.59 51.18,24.13 54.23,15.24 59.69,13.59 62.23,13.59 71.12,17.4 72.01,46.99 77.47,35.18 40.26,26.16 41.53,26.16 42.8,26.16 44.07,26.16 44.07,24.89 44.07,23.62 44.07,22.35 44.07,21.08 44.07,19.81 42.8,19.81 41.53,19.81 40.26,19.81 40.26,21.08 40.26,22.35 40.26,23.62 40.26,24.89 41.53,24.89 42.8,24.89 42.8,23.62 41.53,23.62 41.53,22.35 42.8,22.35 42.8,21.08 41.53,21.08
  pour PWR (isolate 0.305, rank 6): 0,0 89.03,0 89.03,49.91 0,49.91
  pour Top (isolate 0.305, rank 2): 39.75,26.67 44.45,26.67 44.45,19.05 39.75,19.05
5V  (via drill 0.35)  (6 unrouted)
  Top 0.305: C2.1 19.48,8.57 U3.3
  Top 1.016: U4.4 19.48,41.07 v21.59,43.18
  Bottom 0.305: v50.16,36.2 U1.1
  other vias: 24.13,48.26 21.59,45.72 24.13,45.72 25.4,46.99 26.67,48.26 21.59,48.26 26.67,45.72 20.32,46.99 19.05,45.72 19.05,48.26 17.78,46.99 16.51,45.72 16.51,48.26 15.24,46.99 29.21,48.26 29.21,45.72 30.48,46.99 31.75,48.26 31.75,45.72 30.48,44.45 31.75,43.18 29.21,43.18 26.67,43.18 24.13,43.18 22.86,44.45 25.4,44.45 27.94,44.45 20.32,44.45 19.05,43.18 20.32,12.83 21.59,8.51 20.19,2.41 15.37,1.65 36.45,17.78 36.32,20.57
  pour PWR (isolate 0.305, rank 4): 0,0 24.13,0 24.13,15.24 39.37,15.24 39.37,31.75 52.07,31.75 52.07,49.91 0,49.91
  pour Top (isolate 0.305, rank 4): 0,41.91 0,49.91 32,49.91 32,41.91
CANH
  Top 0.305: U3.7 10.79,6.99 10.41,6.6 7.64,6.6 J4.4
  Bottom 0.305: J4.4 5.13,6.62 R11.2
CANL
  Top 0.305: U3.6 10.79,8.26 10.41,8.64 7.64,8.64 J4.3
  Bottom 0.305: J4.3 5.13,8.62 R11.1
CS_CAN
  Top 0.305: 62.07,11.59 60.64,10.16 U$1.16 | 62.07,11.59 R10.1 | U$2.32 66.04,17.07 66.04,13.97 63.66,11.59 62.07,11.59
GND  (via drill 0.35)  (14 unrouted)
  Top 0.305: C2.2 19.48,6.67 U3.2 | J1.S4 J1.SH4 83.12,47.39 J1.SH1 | J1.S5 J1.SH3 75.89,47.39 J1.SH2 76.16,45.08 J1.5 | U$1.9 v48.26,2.54 | U$2.15 69.19,30.86 v69.22,30.86 | U$2.35 72.96,19.96 73.41,19.51 73.41,17.91 v71.12,15.62 | U$2.43 79.2,23.11 81.21,23.11 C8.2 | U$2.23 63.55,26.04 v63.5,26.04 | U$2.5 77.08,31.5 v77.09,31.5 | S1.4 S1.3
  Top 0.813: U4.3 9.14,39.37 v8.89,39.62 | U4.5 9.5,42.77 v8.89,42.16 | U4.6 5.84,39.62 v6.35,39.62
  Bottom 0.305: R18.2 4.89,30.48 C10.- | U1.4 v46.35,36.2
  other vias: 22.86,31.75 22.86,29.21 21.59,30.48 20.32,29.21 20.32,31.75 21.59,6.6 17.91,1.78 8.89,37.08 2.54,40.89 7.62,38.35 7.62,40.89 7.62,43.43 6.35,42.16 6.35,37.08 2.54,43.43 5.08,38.35 5.08,40.89 5.08,43.43 3.81,42.16 3.81,39.62 3.81,37.08 36.32,25.15 2.54,38.35 34.67,17.78 33.4,10.16 33.4,2.54 44.07,17.78 52.45,15.24 58.17,26.67 58.17,39.12 60.33,41.27 82.55,24.51 73.03,39.12 73.03,44.7
  pour GND (isolate 0.305): 0,0 89.03,0 89.03,49.91 0,49.91
  pour Bottom (isolate 0.305, rank 2): 1.02,44.96 12.83,44.96 12.83,33.66 1.02,33.66
MISO  (via drill 0.35)
  Top 0.305: U$1.15 64.9,8.89 J3.9 | U$2.11 71.12,32.33 v71.12,29.59
  Bottom 0.305: v71.12,29.59 67.31,25.78 J3.9
MOSI  (via drill 0.35)
  Top 0.305: U$1.14 60.96,7.62 v62.23,6.35 | v72.13,30.87 v72.14,30.86 72.14,32.21 U$2.10
  Bottom 0.305: v62.23,6.35 63.5,5.08 76.07,5.08 77.41,6.41 | J3.1 77.41,6.41 | v72.14,30.86 72.14,28.19 77.47,22.86 J3.1 | J3.1 77.41,6.41
N$1
  Top 0.305: J1.3 79.5,42.99 R2.1
N$2
  Top 0.305: 80.15,44.62 J1.2 80.15,42.59 R1.1
N$3  (via drill 0.35)
  Top 0.305: J1.1 80.8,44.8 v81.79,43.81
  Bottom 0.305: v81.79,43.81 81.15,43.18 76.98,43.18 L1.1
  other vias: 75.44,41.64
N$4  (via drill 0.35)
  Top 0.305: U$2.44 79.05,24.4 L3.2 | U$2.24 66.29,26.37 v66.29,26.42
  Bottom 0.305: v66.29,26.42 66.29,29.46 70.23,33.4 72.28,33.4 80.01,25.67 L3.2
  other vias: 80.01,24.4
N$5
  Top 0.305: R8.1 LED1.A
N$6
  Top 0.305: R7.1 59.37,11.43 U$1.17
N$7
  Top 0.305: U$2.6 77.47,33.02 C5.2
N$8
  Top 0.305: U$2.22 60.38,24.13 LED3.C
N$9
  Top 0.305: C6.2 59.55,35.12 Y1.2 62.92,32.73 R3.2 65.37,31.84 65.95,31.84 U$2.17
N$10
  Top 0.305: R5.2 LED3.A
N$11
  Top 0.305: C7.2 63.94,40.28 Y1.1 65.82,36.65 R3.1 66.58,33.31 66.58,32.34 U$2.16
N$12  (via drill 0.35)
  Top 0.305: v60.96,22.86 60.96,22.83 59.72,21.59 LED4.C | v75.18,33.4 75.18,33 U$2.8
  Bottom 0.305: v60.96,22.86 60.96,25.4 69.85,34.29 74.3,34.29 v75.18,33.4
N$13
  Top 0.305: LED4.A R6.2
N$14
  Top 1.016: U4.2 24.52,37.67 L2.1 29.1,33.09 D1.C
N$15  (via drill 0.35)
  Bottom 0.305: R18.1 4.89,25.4 C10.+
  other vias: 2.54,19.05 3.81,17.78 3.81,20.32 15.88,34.67 14.61,33.4 17.14,33.4 12.06,33.4 1.91,30.86 1.91,28.32 1.91,25.78 1.91,23.24 3.17,21.97 3.17,24.51 3.17,32.13 4.45,23.24 6.99,23.24 9.53,23.24 12.06,23.24 12.06,25.78 10.79,24.51 9.53,25.78 9.53,28.32 10.79,27.05 8.26,27.05 6.99,28.32 10.79,29.59 10.79,32.13 9.53,30.86 12.06,30.86 14.61,30.86 17.14,30.86 17.14,28.32 14.61,28.32 12.06,28.32 13.34,29.59 13.34,32.13 15.88,32.13 15.88,29.59 15.88,27.05 13.34,27.05 8.26,32.13 8.26,29.59 8.26,24.51
  pour PWR (isolate 0.305, rank 2): 0,15.24 6.35,15.24 6.35,22.86 12.7,22.86 12.7,26.67 17.78,26.67 17.78,38.1 0,38.1
  pour Top (isolate 0.305, rank 4): 0,38.1 17.78,38.1 17.78,26.67 12.7,26.67 12.7,22.86 6.35,22.86 6.35,15.24 1.27,15.24 0,15.24
  cutout Top (isolate 0.305, rank 4): 10.16,38.1 10.16,35.05 13.08,35.05 13.08,36.7 14.22,36.7 14.22,38.1
N$18
  Top 0.305: 13.65,5.71 U3.8 15.49,4.08 15.49,3.74 | 15.49,3.74 R12.1 | R13.2 15.49,3.74
OSC1
  Top 0.305: C3.2 36.83,4.13 R9.2 38.1,5.4 39.56,3.94 Q3.2 41.78,3.94 41.91,3.81 U$1.8
OSC2
  Top 0.305: C4.2 36.83,8.57 R9.1 38.1,7.3 39.56,8.76 Q3.1 44.32,5.08 U$1.7
RST  (via drill 0.35)
  Top 0.305: R4.2 69.22,46.03 S1.2 S1.1 68.58,38.48 68.58,33.73 U$2.13 70.23,32.08 70.23,28.45 v71.25,27.43
  Bottom 0.305: v71.25,27.43 71.25,24 72.39,22.86 J3.5
RX  (via drill 0.35)
  Top 0.305: 65.29,29.07 U$2.20 63.15,31.24 v61.85,31.24
  Bottom 0.305: U1.2 48.9,32.38 50.04,31.24 v61.85,31.24
RX_3V3
  Top 0.305: Q1.2 R14.1 30.8,13.97 46.99,13.97 47.88,13.08 47.88,12.06 47.24,11.43 U$1.2
RX_5V
  Top 0.305: U3.4 19.8,10.16 Q1.3 23.03,12.08 R15.1
RX_N
  Bottom 0.305: U1.7 48.9,41.53 49.28,41.91 49.28,43.16 J2.3
RX_P
  Bottom 0.305: U1.8 50.16,41.53 51.26,42.62 J2.2
SCK  (via drill 0.35)
  Top 0.305: U$1.13 60.96,6.35 62.23,5.08 68.58,5.08 69.85,6.35 J3.7 | U$2.9 73.49,32.47 73.08,32.06 73.08,27.36 v69.85,24.13
  Bottom 0.305: v69.85,24.13 J3.7
TX  (via drill 0.35)
  Top 0.305: v60.45,30.1 63.17,30.1 U$2.21
  Bottom 0.305: U1.3 47.62,32 49.53,30.1 v60.45,30.1
TX_3V3
  Top 0.305: Q2.2 R16.1 31.75,9.84 31.75,11.43 33.02,12.7 U$1.1
TX_5V
  Top 0.305: U3.1 19.8,5.08 Q2.3 23.03,3.28 R17.1
TX_N
  Bottom 0.305: J2.4 47.26,42.02 47.62,41.66 U1.6
TX_P
  Bottom 0.305: J2.5 45.26,42.67 46.35,41.58 U1.5
USB_N
  Top 0.305: R1.2 80.74,40.04 80.74,37.31 81.51,36.54 81.51,33.68 77.52,29.69 77.52,29.67 U$2.3
USB_P
  Top 0.305: R2.2 78.49,38.52 80.8,36.21 80.8,34.09 U$2.4
V_USB  (via drill 0.35)
  Top 0.305: U$2.7 76.07,32.75 76.07,34.04 75.44,34.67 v75.44,39.62 L1.2
  Bottom 0.305: v75.44,39.62 70.74,34.92 69.22,34.92 62.23,27.94 52.07,27.94 51.12,26.99 R8.2
  other vias: 51.12,26.67
VCC  (via drill 0.35)  (1 unrouted)
  other vias: 11.43,20.32 10.16,19.05 11.43,17.78 8.89,17.78 8.89,20.32
  pour PWR (isolate 0.305, rank 3): 0,10.16 12.7,10.16 12.7,22.86 11.43,22.86 0,22.86